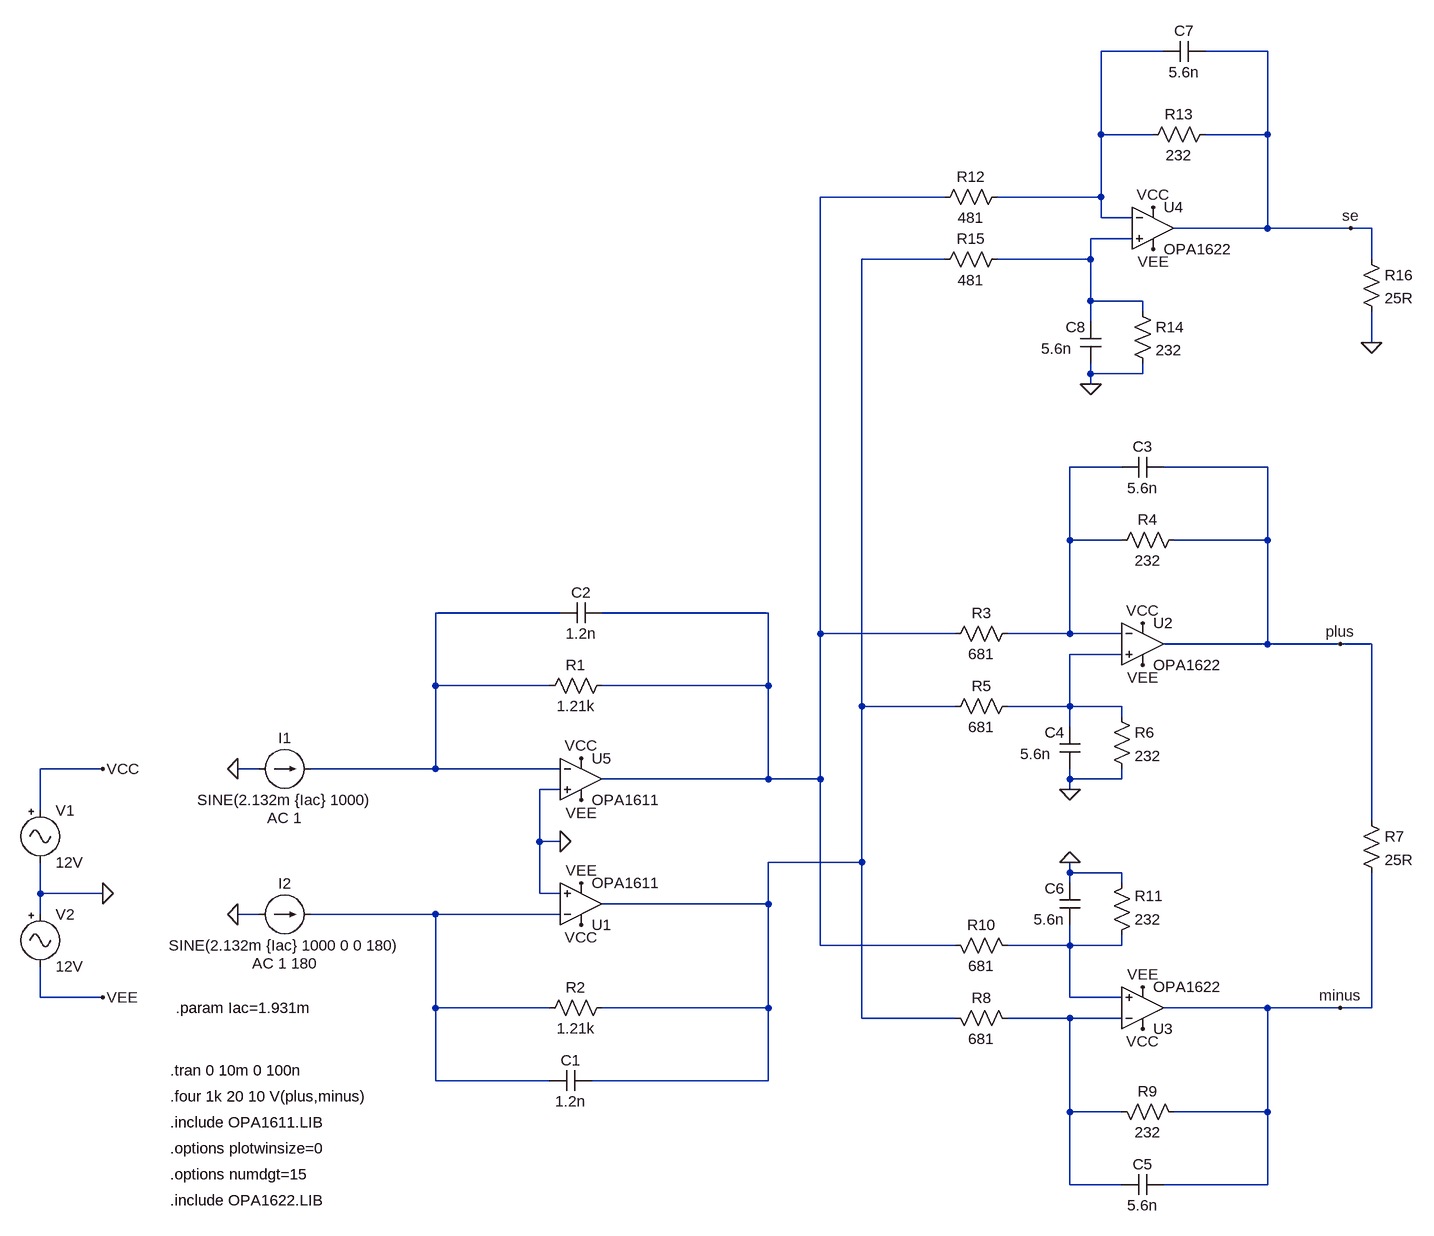
[diagram p0: schematic es9038out.asc]
es9038out.asc, the LTspice schematic file:
Version 4
SHEET 1 2148 1200
WIRE 1664 -1024 1568 -1024
WIRE 1824 -1024 1728 -1024
WIRE 1568 -896 1568 -1024
WIRE 1648 -896 1568 -896
WIRE 1824 -896 1824 -1024
WIRE 1824 -896 1728 -896
WIRE 1328 -800 1136 -800
WIRE 1568 -800 1568 -896
WIRE 1568 -800 1408 -800
WIRE 1568 -768 1568 -800
WIRE 1616 -768 1568 -768
WIRE 1824 -752 1824 -896
WIRE 1824 -752 1680 -752
WIRE 1952 -752 1824 -752
WIRE 1984 -752 1952 -752
WIRE 1616 -736 1552 -736
WIRE 1328 -704 1200 -704
WIRE 1552 -704 1552 -736
WIRE 1552 -704 1408 -704
WIRE 1984 -704 1984 -752
WIRE 1552 -640 1552 -704
WIRE 1632 -640 1552 -640
WIRE 1632 -624 1632 -640
WIRE 1552 -608 1552 -640
WIRE 1984 -576 1984 -624
WIRE 1552 -528 1552 -544
WIRE 1632 -528 1632 -544
WIRE 1632 -528 1552 -528
WIRE 1552 -512 1552 -528
WIRE 1600 -384 1520 -384
WIRE 1824 -384 1664 -384
WIRE 1520 -272 1520 -384
WIRE 1600 -272 1520 -272
WIRE 1824 -272 1824 -384
WIRE 1824 -272 1680 -272
WIRE 736 -160 544 -160
WIRE 1056 -160 800 -160
WIRE 1136 -128 1136 -800
WIRE 1344 -128 1136 -128
WIRE 1520 -128 1520 -272
WIRE 1520 -128 1424 -128
WIRE 1600 -128 1520 -128
WIRE 1824 -112 1824 -272
WIRE 1824 -112 1664 -112
WIRE 1936 -112 1824 -112
WIRE 1984 -112 1936 -112
WIRE 1600 -96 1520 -96
WIRE 544 -48 544 -160
WIRE 720 -48 544 -48
WIRE 1056 -48 1056 -160
WIRE 1056 -48 800 -48
WIRE 1200 -16 1200 -704
WIRE 1344 -16 1200 -16
WIRE 1520 -16 1520 -96
WIRE 1520 -16 1424 -16
WIRE 1600 -16 1520 -16
WIRE 1600 0 1600 -16
WIRE 1520 16 1520 -16
WIRE 32 80 -64 80
WIRE 272 80 240 80
WIRE 544 80 544 -48
WIRE 544 80 352 80
WIRE 736 80 544 80
WIRE 1056 96 1056 -48
WIRE 1056 96 800 96
WIRE 1136 96 1136 -128
WIRE 1136 96 1056 96
WIRE 1520 96 1520 80
WIRE 1600 96 1600 80
WIRE 1600 96 1520 96
WIRE 736 112 704 112
WIRE 1520 112 1520 96
WIRE -64 144 -64 80
WIRE 1984 160 1984 -112
WIRE 704 192 704 112
WIRE 736 192 704 192
WIRE 1200 224 1200 -16
WIRE 1200 224 1056 224
WIRE 1520 240 1520 224
WIRE 1600 240 1520 240
WIRE 1520 256 1520 240
WIRE 1600 256 1600 240
WIRE -64 272 -64 224
WIRE 32 272 -64 272
WIRE 704 272 704 192
WIRE 736 272 704 272
WIRE 1056 288 1056 224
WIRE 1056 288 800 288
WIRE -64 304 -64 272
WIRE 272 304 240 304
WIRE 544 304 352 304
WIRE 736 304 544 304
WIRE 1136 352 1136 96
WIRE 1344 352 1136 352
WIRE 1520 352 1520 320
WIRE 1520 352 1424 352
WIRE 1600 352 1600 336
WIRE 1600 352 1520 352
WIRE -64 432 -64 384
WIRE 32 432 -64 432
WIRE 1520 432 1520 352
WIRE 1600 432 1520 432
WIRE 544 448 544 304
WIRE 720 448 544 448
WIRE 1056 448 1056 288
WIRE 1056 448 800 448
WIRE 1824 448 1664 448
WIRE 1936 448 1824 448
WIRE 1984 448 1984 240
WIRE 1984 448 1936 448
WIRE 1200 464 1200 224
WIRE 1344 464 1200 464
WIRE 1520 464 1424 464
WIRE 1600 464 1520 464
WIRE 544 560 544 448
WIRE 720 560 544 560
WIRE 1056 560 1056 448
WIRE 1056 560 784 560
WIRE 1520 608 1520 464
WIRE 1600 608 1520 608
WIRE 1824 608 1824 448
WIRE 1824 608 1680 608
WIRE 1520 720 1520 608
WIRE 1600 720 1520 720
WIRE 1824 720 1824 608
WIRE 1824 720 1664 720
FLAG 240 80 0
FLAG 240 304 0
FLAG 32 272 0
FLAG 32 80 VCC
FLAG 32 432 VEE
FLAG 736 192 0
FLAG 768 64 VCC
FLAG 768 320 VCC
FLAG 768 256 VEE
FLAG 768 128 VEE
FLAG 1632 -144 VCC
FLAG 1632 -80 VEE
FLAG 1520 112 0
FLAG 1936 -112 plus
FLAG 1632 480 VCC
FLAG 1632 416 VEE
FLAG 1520 224 0
FLAG 1936 448 minus
FLAG 1552 -512 0
FLAG 1648 -784 VCC
FLAG 1648 -720 VEE
FLAG 1984 -576 0
FLAG 1952 -752 se
SYMBOL current 272 80 R270
WINDOW 0 32 40 VTop 2
WINDOW 3 -32 40 VBottom 2
WINDOW 123 -60 40 VBottom 2
WINDOW 39 0 0 Left 0
SYMATTR InstName I1
SYMATTR Value SINE(2.132m {Iac} 1000)
SYMATTR Value2 AC 1
SYMBOL current 272 304 R270
WINDOW 0 32 40 VTop 2
WINDOW 3 -32 40 VBottom 2
WINDOW 123 -60 40 VBottom 2
WINDOW 39 0 0 Left 0
SYMATTR InstName I2
SYMATTR Value SINE(2.132m {Iac} 1000 0 0 180)
SYMATTR Value2 AC 1 180
SYMBOL Misc\\signal -64 128 R0
WINDOW 123 0 0 Left 0
WINDOW 39 0 0 Left 0
SYMATTR InstName V1
SYMATTR Value 12V
SYMBOL Misc\\signal -64 288 R0
WINDOW 123 0 0 Left 0
WINDOW 39 0 0 Left 0
SYMATTR InstName V2
SYMATTR Value 12V
SYMBOL res 816 -64 R90
WINDOW 0 0 56 VBottom 2
WINDOW 3 32 56 VTop 2
SYMATTR InstName R1
SYMATTR Value 1.21k
SYMBOL res 816 432 R90
WINDOW 0 0 56 VBottom 2
WINDOW 3 32 56 VTop 2
SYMATTR InstName R2
SYMATTR Value 1.21k
SYMBOL cap 784 544 R90
WINDOW 0 0 32 VBottom 2
WINDOW 3 32 32 VTop 2
SYMATTR InstName C1
SYMATTR Value 1.2n
SYMBOL cap 800 -176 R90
WINDOW 0 0 32 VBottom 2
WINDOW 3 32 32 VTop 2
SYMATTR InstName C2
SYMATTR Value 1.2n
SYMBOL res 1440 -144 R90
WINDOW 0 0 56 VBottom 2
WINDOW 3 32 56 VTop 2
SYMATTR InstName R3
SYMATTR Value 681
SYMBOL res 1696 -288 R90
WINDOW 0 0 56 VBottom 2
WINDOW 3 32 56 VTop 2
SYMATTR InstName R4
SYMATTR Value 232
SYMBOL OpAmps\\opamp2 768 32 R0
SYMATTR InstName U5
SYMATTR Value OPA1611
SYMATTR SpiceModel OPA1611
SYMBOL OpAmps\\opamp2 768 352 M180
SYMATTR InstName U1
SYMATTR Value OPA1611
SYMATTR SpiceModel OPA1611
SYMBOL cap 1664 -400 R90
WINDOW 0 0 32 VBottom 2
WINDOW 3 32 32 VTop 2
SYMATTR InstName C3
SYMATTR Value 5.6n
SYMBOL res 1440 -32 R90
WINDOW 0 0 56 VBottom 2
WINDOW 3 32 56 VTop 2
SYMATTR InstName R5
SYMATTR Value 681
SYMBOL res 1584 -16 R0
SYMATTR InstName R6
SYMATTR Value 232
SYMBOL cap 1536 80 R180
WINDOW 0 24 56 Left 2
WINDOW 3 45 23 Left 2
SYMATTR InstName C4
SYMATTR Value 5.6n
SYMBOL res 1440 480 M270
WINDOW 0 32 56 VTop 2
WINDOW 3 0 56 VBottom 2
SYMATTR InstName R8
SYMATTR Value 681
SYMBOL res 1696 624 M270
WINDOW 0 32 56 VTop 2
WINDOW 3 0 56 VBottom 2
SYMATTR InstName R9
SYMATTR Value 232
SYMBOL cap 1664 736 M270
WINDOW 0 32 32 VTop 2
WINDOW 3 0 32 VBottom 2
SYMATTR InstName C5
SYMATTR Value 5.6n
SYMBOL res 1440 368 M270
WINDOW 0 32 56 VTop 2
WINDOW 3 0 56 VBottom 2
SYMATTR InstName R10
SYMATTR Value 681
SYMBOL res 1584 352 M180
WINDOW 0 36 76 Left 2
WINDOW 3 36 40 Left 2
SYMATTR InstName R11
SYMATTR Value 232
SYMBOL cap 1536 256 M0
SYMATTR InstName C6
SYMATTR Value 5.6n
SYMBOL res 1968 144 R0
SYMATTR InstName R7
SYMATTR Value 25R
SYMBOL OpAmps\\opamp2 1648 -816 R0
SYMATTR InstName U4
SYMATTR Value OPA1622
SYMATTR SpiceModel OPA1622
SYMBOL res 1424 -816 R90
WINDOW 0 0 56 VBottom 2
WINDOW 3 32 56 VTop 2
SYMATTR InstName R12
SYMATTR Value 481
SYMBOL res 1744 -912 R90
WINDOW 0 0 56 VBottom 2
WINDOW 3 32 56 VTop 2
SYMATTR InstName R13
SYMATTR Value 232
SYMBOL cap 1728 -1040 R90
WINDOW 0 0 32 VBottom 2
WINDOW 3 32 32 VTop 2
SYMATTR InstName C7
SYMATTR Value 5.6n
SYMBOL res 1616 -640 R0
SYMATTR InstName R14
SYMATTR Value 232
SYMBOL cap 1568 -544 R180
WINDOW 0 24 56 Left 2
WINDOW 3 45 23 Left 2
SYMATTR InstName C8
SYMATTR Value 5.6n
SYMBOL res 1424 -720 R90
WINDOW 0 0 56 VBottom 2
WINDOW 3 32 56 VTop 2
SYMATTR InstName R15
SYMATTR Value 481
SYMBOL res 1968 -720 R0
SYMATTR InstName R16
SYMATTR Value 25R
SYMBOL OpAmps\\opamp2 1632 -176 R0
SYMATTR InstName U2
SYMATTR Value OPA1622
SYMATTR SpiceModel OPA1622
SYMBOL OpAmps\\opamp2 1632 512 M180
SYMATTR InstName U3
SYMATTR Value OPA1622
SYMATTR SpiceModel OPA1622
TEXT 136 544 Left 2 !.tran 0 10m 0 100n
TEXT 136 584 Left 2 !.four 1k 20 10 V(plus,minus)
TEXT 136 624 Left 2 !.include OPA1611.LIB
TEXT 136 664 Left 2 !.options plotwinsize=0
TEXT 136 704 Left 2 !.options numdgt=15
TEXT 144 448 Left 2 !.param Iac=1.931m
TEXT 136 744 Left 2 !.include OPA1622.LIB

The netlist it stands for:
* es9038out.asc
I1 0 N006 SINE(2.132m {Iac} 1000) AC 1
I2 0 N008 SINE(2.132m {Iac} 1000 0 0 180) AC 1 180
V1 VCC 0 12V
V2 0 VEE 12V
R1 N002 N006 1.21k
R2 N004 N008 1.21k
C1 N004 N008 1.2n
C2 N002 N006 1.2n
R3 N005 N002 681
R4 plus N005 232
XU5 0 N006 VCC VEE N002 OPA1611 OPA1611  ; pins In+ In- V+ V- OUT
XU1 0 N008 VCC VEE N004 OPA1611 OPA1611  ; pins In+ In- V+ V- OUT
C3 plus N005 5.6n
R5 N007 N004 681
R6 N007 0 232
C4 0 N007 5.6n
R8 N010 N004 681
R9 minus N010 232
C5 minus N010 5.6n
R10 N009 N002 681
R11 N009 0 232
C6 0 N009 5.6n
R7 plus minus 25R
XU4 N003 N001 VCC VEE se OPA1622 OPA1622  ; pins In+ In- V+ V- OUT
R12 N001 N002 481
R13 se N001 232
C7 se N001 5.6n
R14 N003 0 232
C8 0 N003 5.6n
R15 N003 N004 481
R16 se 0 25R
XU2 N007 N005 VCC VEE plus OPA1622 OPA1622  ; pins In+ In- V+ V- OUT
XU3 N009 N010 VCC VEE minus OPA1622 OPA1622  ; pins In+ In- V+ V- OUT
.tran 0 10m 0 100n
.four 1k 20 10 V(plus,minus)
.include OPA1611.LIB
.options plotwinsize=0
.options numdgt=15
.param Iac=1.931m
.include OPA1622.LIB
.backanno
.end